# EAGLE design trainer (EAGLE 7.3.0)
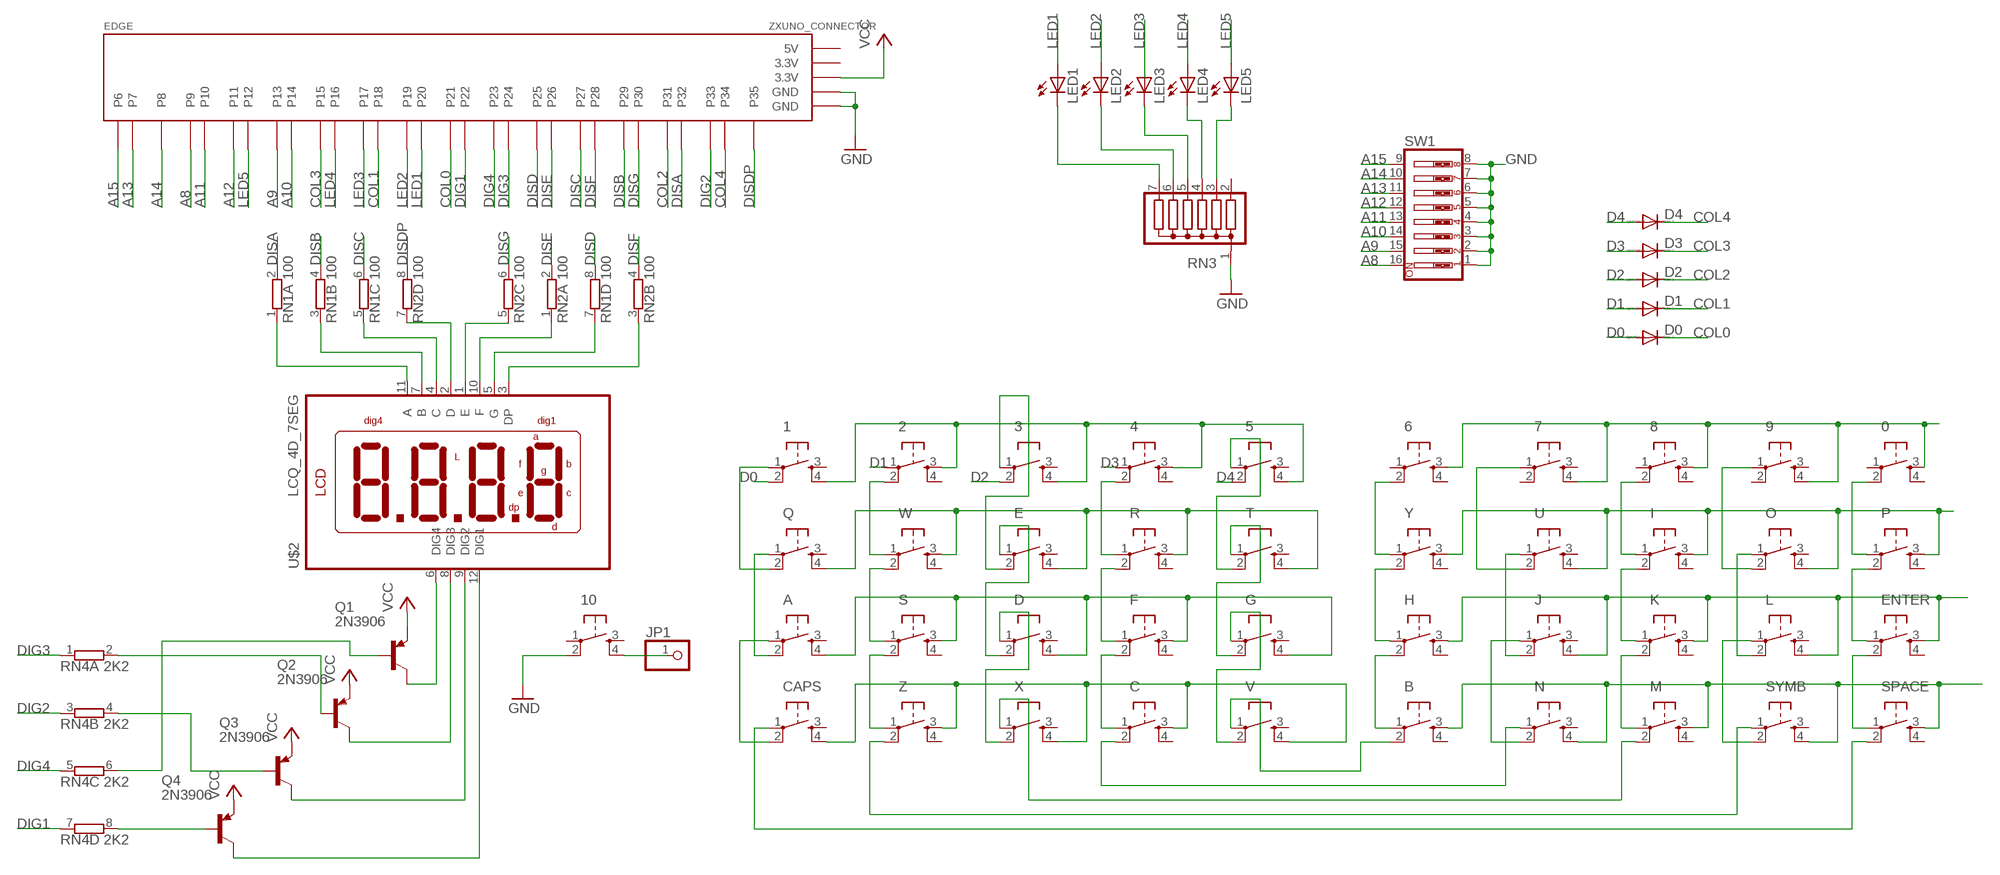
[diagram p0: schematic, sheet 1]

## Parts
0  DTS-6  [DTS-6]
1  DTS-6  [DTS-6]
2  DTS-6  [DTS-6]
3  DTS-6  [DTS-6]
4  DTS-6  [DTS-6]
5  DTS-6  [DTS-6]
6  DTS-6  [DTS-6]
7  DTS-6  [DTS-6]
8  DTS-6  [DTS-6]
9  DTS-6  [DTS-6]
10  DTS-6  [DTS-6]
A  DTS-6  [DTS-6]
B  DTS-6  [DTS-6]
C  DTS-6  [DTS-6]
CAPS  DTS-6  [DTS-6]
D  DTS-6  [DTS-6]
D0  1N4148DO35-7  [DO35-7]
D1  1N4148DO35-7  [DO35-7]
D2  1N4148DO35-7  [DO35-7]
D3  1N4148DO35-7  [DO35-7]
D4  1N4148DO35-7  [DO35-7]
E  DTS-6  [DTS-6]
EDGE  ZXUNO_CONNECTOR  [ZXUNO_CONNECTOR]
ENTER  DTS-6  [DTS-6]
F  DTS-6  [DTS-6]
G  DTS-6  [DTS-6]
H  DTS-6  [DTS-6]
I  DTS-6  [DTS-6]
J  DTS-6  [DTS-6]
JP1  PINHD-1X1  [1X01]
K  DTS-6  [DTS-6]
L  DTS-6  [DTS-6]
LED1  LED3MM  [LED3MM]
LED2  LED3MM  [LED3MM]
LED3  LED3MM  [LED3MM]
LED4  LED3MM  [LED3MM]
LED5  LED3MM  [LED3MM]
M  DTS-6  [DTS-6]
N  DTS-6  [DTS-6]
O  DTS-6  [DTS-6]
P  DTS-6  [DTS-6]
Q  DTS-6  [DTS-6]
Q1  2N3906  [TO92]
Q2  2N3906  [TO92]
Q3  2N3906  [TO92]
Q4  2N3906  [TO92]
R  DTS-6  [DTS-6]
RN1  100  E4R  [SIL8]
RN2  100  E4R  [SIL8]
RN3  G06R  [SIL7]
RN4  2K2  E4R  [SIL8]
S  DTS-6  [DTS-6]
SPACE  DTS-6  [DTS-6]
SW1  SW_DIP-8  [EDG-08]
SYMB  DTS-6  [DTS-6]
T  DTS-6  [DTS-6]
U  DTS-6  [DTS-6]
U$2  LCQ_4D_7SEG  [LDQ_4D_7SEG]
V  DTS-6  [DTS-6]
W  DTS-6  [DTS-6]
X  DTS-6  [DTS-6]
Y  DTS-6  [DTS-6]
Z  DTS-6  [DTS-6]

## Nets
A8: C.3 CAPS.4 EDGE.P9 SW1.16 V.4 X.4 Z.3
A9: A.4 D.4 EDGE.P13 F.3 G.4 S.3 SW1.15
A10: E.4 EDGE.P14 Q.4 R.3 SW1.14 T.4 W.3
A11: 1.4 2.3 3.4 4.3 5.4 EDGE.P10 SW1.13
A12: 0.3 6.3 7.4 8.3 9.4 EDGE.P11 SW1.12
A13: EDGE.P7 I.3 O.4 P.3 SW1.11 U.4 Y.3
A14: EDGE.P8 ENTER.3 H.3 J.4 K.3 L.4 SW1.10
A15: B.3 EDGE.P6 M.3 N.4 SPACE.3 SW1.9 SYMB.4
COL0: D0.C EDGE.P21
COL1: D1.C EDGE.P18
COL2: D2.C EDGE.P31
COL3: D3.C EDGE.P15
COL4: D4.C EDGE.P34
D0: 1.2 D0.A
D1: 2.1 D1.A
D2: 3.2 D2.A
D3: 4.1 D3.A
D4: 5.2 D4.A
DIG1: EDGE.P22 RN4.7
DIG2: EDGE.P33 RN4.3
DIG3: EDGE.P24 RN4.1
DIG4: EDGE.P23 RN4.5
DISA: EDGE.P32 RN1.2
DISB: EDGE.P29 RN1.4
DISC: EDGE.P27 RN1.6
DISD: EDGE.P25 RN1.8
DISDP: EDGE.P35 RN2.8
DISE: EDGE.P26 RN2.2
DISF: EDGE.P28 RN2.4
DISG: EDGE.P30 RN2.6
ELETE: M.2 X.1
GND: 10.2 EDGE.GND@1(GND) EDGE.GND@2(GND) RN3.1 SW1.1 SW1.2 SW1.3 SW1.4 SW1.5 SW1.6 SW1.7 SW1.8
LED1: EDGE.P20 LED1.A
LED2: EDGE.P19 LED2.A
LED3: EDGE.P17 LED3.A
LED4: EDGE.P16 LED4.A
LED5: EDGE.P12 LED5.A
N$1: Q1.1(C) U$2.6(DIG4)
N$2: Q2.1(C) U$2.8(DIG3)
N$3: Q3.1(C) U$2.9(DIG2)
N$4: Q4.1(C) U$2.12(DIG1)
N$5: Q2.2(B) RN4.2
N$6: Q1.2(B) RN4.6
N$7: Q3.2(B) RN4.4
N$8: Q4.2(B) RN4.8
N$9: RN1.1 U$2.11(A)
N$10: RN1.3 U$2.7(B)
N$11: RN1.5 U$2.4(C)
N$12: RN2.7 U$2.2(D)
N$13: RN2.5 U$2.1(E)
N$14: RN2.1 U$2.10(F)
N$15: 10.4 JP1.1
N$16: S.1 W.2
N$17: S.2 Z.1
N$18: RN2.3 U$2.3(DP)
N$19: SYMB.1 Z.2
N$20: RN1.7 U$2.5(G)
N$21: C.1 F.2
N$22: CAPS.1 SPACE.2
N$23: 4.2 R.1
N$24: F.1 R.2
N$25: LED4.K(C) RN3.4
N$26: LED5.K(C) RN3.3
N$27: LED3.K(C) RN3.5
N$28: B.2 V.1
N$29: 5.1 T.2
N$30: G.2 T.1
N$31: A.2 Q.1
N$32: J.2 U.1
N$33: J.1 N.2
N$34: 3.1 E.2
N$35: D.2 E.1
N$36: A.1 CAPS.2
N$37: 1.1 Q.2
N$38: K.2 M.1
N$39: 2.2 W.1
N$40: 7.1 U.2
N$41: LED2.K(C) RN3.6
N$42: G.1 V.2
N$43: C.2 N.1
N$44: L.1 SYMB.2
N$46: LED1.K(C) RN3.7
N$47: I.2 K.1
N$48: 8.2 I.1
N$49: L.2 O.1
N$50: B.1 H.2
N$51: H.1 Y.2
N$52: ENTER.2 SPACE.1
N$53: ENTER.1 P.2
N$54: 0.2 P.1
N$55: 6.2 Y.1
N$56: 9.1 O.2
N$74: D.1 X.2
VCC: EDGE.3.3V@2(3.3V) Q1.3(E) Q2.3(E) Q3.3(E) Q4.3(E)
Unconnected: 0.1 0.4 1.3 2.4 3.3 4.4 5.3 6.1 6.4 7.2 7.3 8.1 8.4 9.2 9.3 10.1 10.3 A.3 B.4 C.4 CAPS.3 D.3 E.3 ENTER.4 F.4 G.3 H.4 I.4 J.3 K.4 L.3 M.4 N.3 O.3 P.4 Q.3 R.4 RN3.2 S.4 SPACE.4 SYMB.3 T.3 U.3 V.3 W.4 X.3 Y.4 Z.4

## Power pins joined to a net without a drawn wire
3.3V: EDGE.3.3V@1(3.3V)
5V: EDGE.5V

## Library data of the parts
0 1-10 A B C CAPS D E ENTER F G H I J K L M N O P Q R S SPACE SYMB T U V W X Y Z = switch-tact:DTS-6
D0 D1-D4 = diode:1N4148: DIODE high speed (Philips)
EDGE = zxuno:ZXUNO_CONNECTOR
JP1 = pinhead:PINHD-1X1: PIN HEADER
LED1-LED5 = led:LED: LED OSRAM: - CHIPLED LG R971, LG N971, LY N971, LG Q971, LY Q971, LO R971, LY R971 LH N974, LH R974 LS Q976, LO Q976, LY Q976 LO Q996 - Hyper CHIPLED LW Q18S LB Q993, LB Q99A, LB R99A - SideLED LS A670, LO A670, LY A670, LG A670, LP A670 LB A673, LV A673, LT A673, LW A673 LH A674 LY A675 LS A676, LA A676, LO A676, LY A676, LW A676 LS A679, LY A679, LG A679 - Hyper Micro SIDELED® LS Y876, LA Y876, LO Y876, LY Y876 LT Y87S - SmartLED LW L88C, LW L88S LB L89C, LB L89S, LG L890 LS L89K, LO L89K, LY L89K LS L896, LA L896, LO L896, LY L896 - TOPLED LS T670, LO T670, LY T670, LG T670, LP T670 LSG T670, LSP T670, LSY T670, LOP T670, LYG T670 LG T671, LOG T671, LSG T671 LB T673, LV T673, LT T673, LW T673 LH T674 LS T676, LA T676, LO T676, LY T676, LB T676, LH T676, LSB T676, LW T676 LB T67C, LV T67C, LT T67C, LS T67K, LO T67K, LY T67K, LW E67C LS E67B, LA E67B, LO E67B, LY E67B, LB E67C, LV E67C, LT E67C LW T67C LS T679, LY T679, LG T679 LS T770, LO T770, LY T770, LG T770, LP T770 LB T773, LV T773, LT T773, LW T773 LH T774 LS E675, LA E675, LY E675, LS T675 LS T776, LA T776, LO T776, LY T776, LB T776 LHGB T686 LT T68C, LB T68C - Hyper Mini TOPLED® LB M676 - Mini TOPLED Santana® LG M470 LS M47K, LO M47K, LY M47K Source: http://www.osram.convergy.de LUXEON: - LUMILED® LXK2-PW12-R00, LXK2-PW12-S00, LXK2-PW14-U00, LXK2-PW14-V00 LXK2-PM12-R00, LXK2-PM12-S00, LXK2-PM14-U00 LXK2-PE12-Q00, LXK2-PE12-R00, LXK2-PE12-S00, LXK2-PE14-T00, LXK2-PE14-U00 LXK2-PB12-K00, LXK2-PB12-L00, LXK2-PB12-M00, LXK2-PB14-N00, LXK2-PB14-P00, LXK2-PB14-Q00 LXK2-PR12-L00, LXK2-PR12-M00, LXK2-PR14-Q00, LXK2-PR14-R00 LXK2-PD12-Q00, LXK2-PD12-R00, LXK2-PD12-S00 LXK2-PH12-R00, LXK2-PH12-S00 LXK2-PL12-P00, LXK2-PL12-Q00, LXK2-PL12-R00 Source: www.luxeon.com KINGBRIGHT: KA-3528ASYC Source: www.kingbright.com
Q1-Q4 = transistor-pnp:2N3906: PNP Transistor
RN1 RN2 RN4 = resistor-sil:E4R: SIL RESISTOR; OC_FARNELL: unknown; OC_NEWARK: unknown
RN3 = resistor-sil:G06R: SIL RESISTOR; OC_FARNELL: unknown; OC_NEWARK: unknown
SW1 = special:SW_DIP-8: DIP SWITCH
U$2 = mylib:LCQ_4D_7SEG

## Board
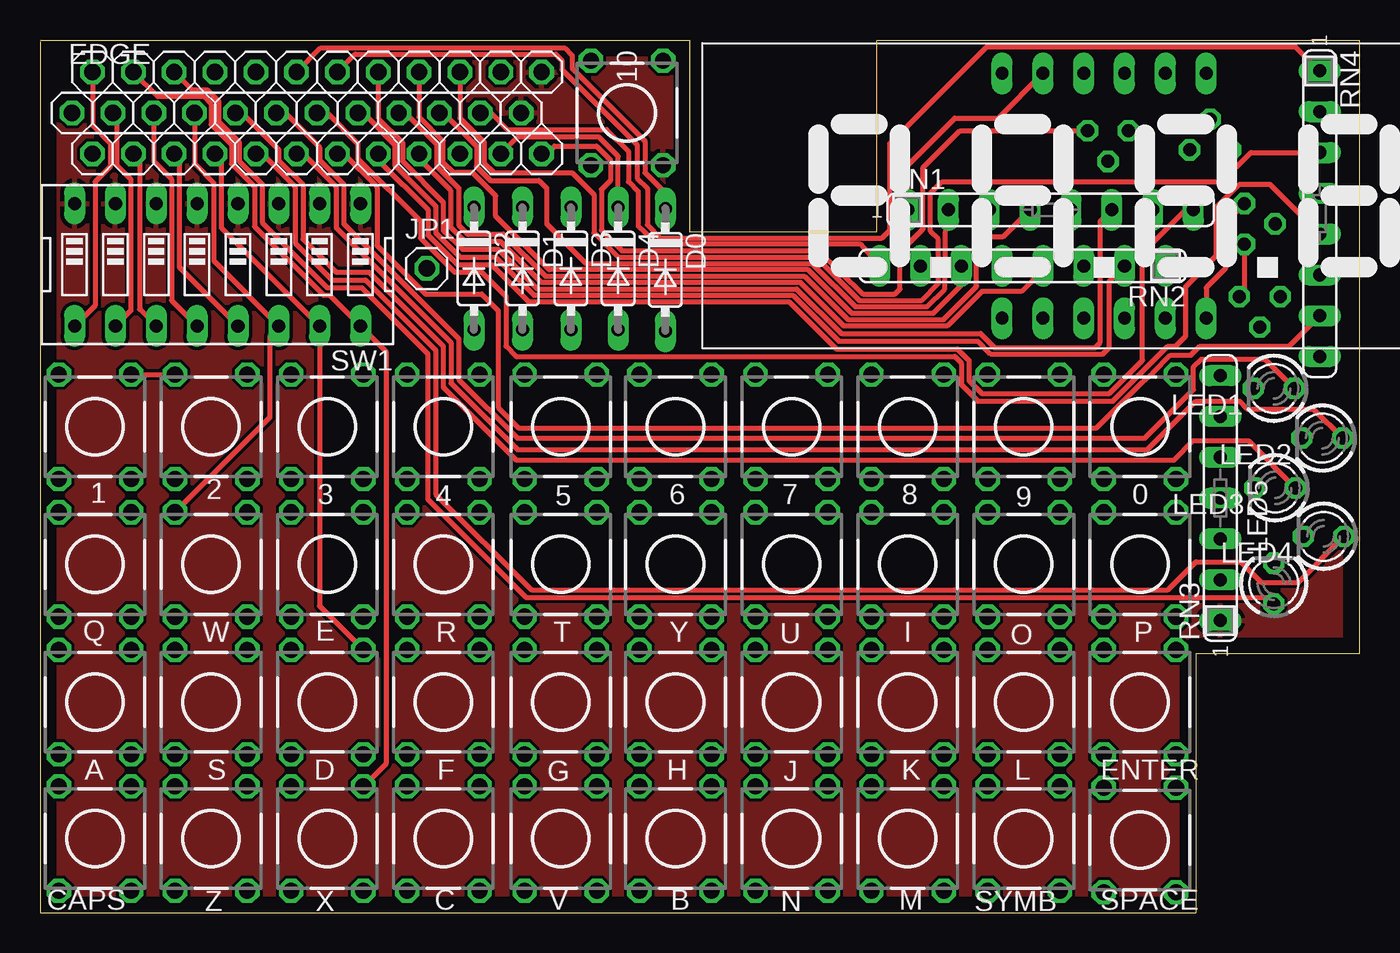
[diagram p1: board, top side]
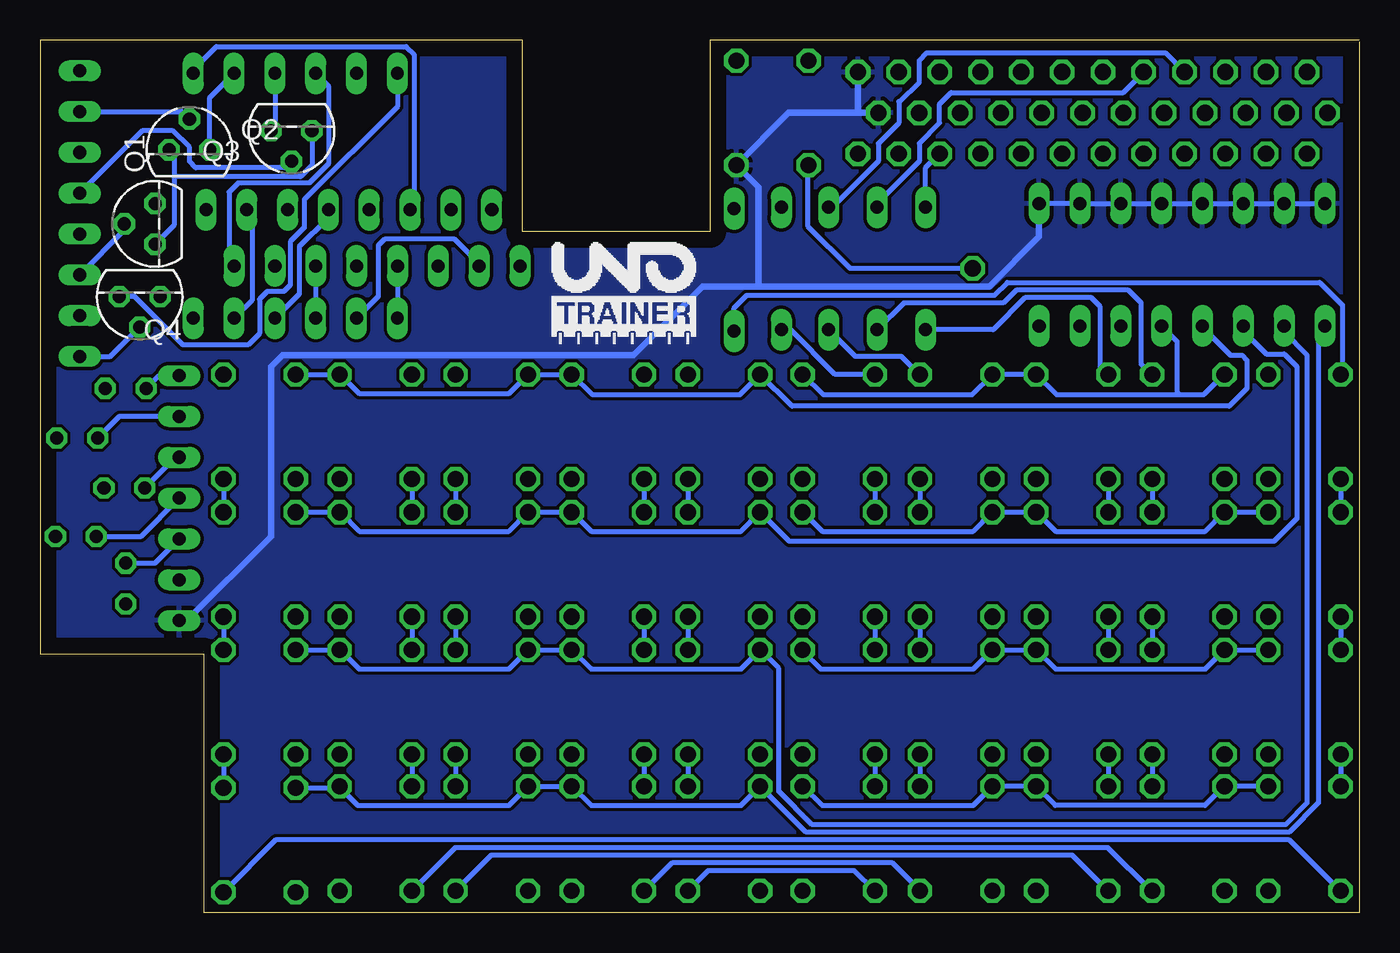
[diagram p2: board, bottom side, seen from below]

Size 82.07 x 54.29 mm. Coordinates in mm from the lower left corner, seen from the top.
Outline: 0,54.2 0,0 71.91,0 71.91,16.11 82.07,16.11 82.07,54.29 52.07,54.29 52.07,42.39 40.4,42.39 40.4,54.29 0,54.29
Copper layers (1*16): Top 0.035mm / dielectric 1.5mm / Bottom 0.035mm
Design rules "default": minimum track width 10mil, minimum drill 24mil, track to track 8mil, track to pad 8mil, pad to pad 8mil, via to via 8mil, smd to smd 8mil, copper to edge 40mil, drill to drill 8mil, minimum pad ring 10mil, minimum via ring 8mil, stop-mask expansion 4mil, vias tented up to drill 0mil, thermal gap 10mil

### Footprints (pad centres in the part's own frame; a part is rotated, then mirrored left to right if it is on the bottom)
DTS-6 = drill 1 octagon: 1 -3.25,2.25; 2 3.25,2.25; 3 -3.25,-2.25; 4 3.25,-2.25
DO35-7 = drill 0.813 long: A 3.81,0; C -3.81,0
ZXUNO_CONNECTOR = drill 1.016 octagon: 3.3V@1 -13.97,0; 3.3V@2 15.24,-2.54; 5V -12.7,-2.54; GND@1 15.24,2.54; GND@2 13.97,0; NC@1 12.7,2.54; P6 -12.7,2.54; P7 -10.16,-2.54; P8 -11.43,0; P9 -10.16,2.54; P10 -7.62,-2.54; P11 -8.89,0; P12 -7.62,2.54; P13 -5.08,-2.54; P14 -6.35,0; P15 -5.08,2.54; P16 -2.54,-2.54; P17 -3.81,0; P18 -2.54,2.54; P19 0,-2.54; P20 -1.27,0; P21 0,2.54; P22 2.54,-2.54; P23 1.27,0; P24 2.54,2.54; P25 5.08,-2.54; P26 3.81,0; P27 5.08,2.54; P28 7.62,-2.54; P29 6.35,0; P30 7.62,2.54; P31 10.16,-2.54; P32 8.89,0; P33 10.16,2.54; P34 12.7,-2.54; P35 11.43,0
1X01 = drill 1.016 octagon: 1 0,0
LED3MM = drill 0.813 octagon: A -1.27,0; K 1.27,0
TO92 = drill 0.813 octagon: 1 1.27,0; 2 0,1.905; 3 -1.27,0
SIL8 = drill 0.813 long: 1 -8.89,0; 2 -6.35,0; 3 -3.81,0; 4 -1.27,0; 5 1.27,0; 6 3.81,0; 7 6.35,0; 8 8.89,0
SIL7 = drill 0.813 long: 1 -7.62,0; 2 -5.08,0; 3 -2.54,0; 4 0,0; 5 2.54,0; 6 5.08,0; 7 7.62,0
EDG-08 = drill 0.813 long: 1 -8.89,-3.81; 2 -6.35,-3.81; 3 -3.81,-3.81; 4 -1.27,-3.81; 5 1.27,-3.81; 6 3.81,-3.81; 7 6.35,-3.81; 8 8.89,-3.81; 9 8.89,3.81; 10 6.35,3.81; 11 3.81,3.81; 12 1.27,3.81; 13 -1.27,3.81; 14 -3.81,3.81; 15 -6.35,3.81; 16 -8.89,3.81
LDQ_4D_7SEG = drill 0.8 long: 1 -6.35,-7.62; 2 -3.81,-7.62; 3 -1.27,-7.62; 4 1.27,-7.62; 5 3.81,-7.62; 6 6.35,-7.62; 7 6.35,7.62; 8 3.81,7.62; 9 1.27,7.62; 10 -1.27,7.62; 11 -3.81,7.62; 12 -6.35,7.62

### Placement (x,y rotation side)
0  68.42,30.24 270 top
1  3.41,30.24 90 top
2  10.64,30.24 270 top
3  17.86,30.24 90 top
4  25.08,30.24 270 top
5  32.38,30.24 90 top
6  39.53,30.24 270 top
7  46.75,30.24 90 top
8  53.98,30.24 270 top
9  61.2,30.24 90 top
10  36.51,49.77 270 top
A  3.41,13.1 90 top
B  39.53,4.6 270 top
C  25.08,4.6 270 top
CAPS  3.41,4.6 90 top
D  17.86,13.1 90 top
D0  38.89,40.01 270 top
D1  30,40.08 270 top
D2  26.99,40.08 270 top
D3  33.02,40.08 270 top
D4  35.96,40.08 270 top
E  17.86,21.67 90 top
EDGE  15.95,49.77 0 top
ENTER  68.42,13.1 270 top
F  25.08,13.1 270 top
G  32.38,13.1 90 top
H  39.53,13.1 270 top
I  53.98,21.67 270 top
J  46.75,13.1 90 top
JP1  24.05,40.08 0 top
K  53.98,13.1 270 top
L  61.2,13.1 90 top
LED1  76.76,32.62 180 top
LED2  79.77,29.53 180 top
LED3  76.83,26.43 180 top
LED4  79.85,23.42 180 top
LED5  76.76,20.48 90 top
M  53.98,4.6 270 top
N  46.75,4.6 90 top
O  61.2,21.67 90 top
P  68.42,21.67 270 top
Q  3.41,21.67 90 top
Q1  74.93,42.86 90 bottom
Q2  72.79,47.47 0 bottom
Q3  66.44,48.66 180 bottom
Q4  75.88,38.34 180 bottom
R  25.08,21.67 270 top
RN1  62.87,43.74 0 top
RN2  61.12,40.24 180 top
RN3  73.42,25.8 90 top
RN4  79.61,43.5 270 top
S  10.64,13.1 270 top
SPACE  68.42,4.52 270 top
SW1  11.03,40.32 180 top
SYMB  61.2,4.6 90 top
T  32.38,21.67 90 top
U  46.75,21.67 90 top
U$2  66.2,44.61 0 top
V  32.38,4.6 90 top
W  10.64,21.67 270 top
X  17.86,4.6 90 top
Y  39.53,21.67 270 top
Z  10.64,4.6 270 top

### Tracks (layer width: path | path; a pad name or v marks a point on that pad's centre or on a via)
A8
  Top 0.305: X.4 21.51,9.26 21.51,34.92 SW1.16 18.02,38.42 17.62,38.42 13.34,42.7 13.34,45.16 11.91,46.59 11.91,47.78 10.64,49.05 10.64,50.32 10.16,50.8 7.3,50.8 EDGE.P9
  Bottom 0.305: CAPS.4 Z.3 8.42,7.85 9.6,6.67 18.92,6.67 X.4 C.3 24.02,6.67 33.42,6.67 34.6,7.85 V.4
A9
  Top 0.305: D.4 17.38,19.07 SW1.15 11.27,42.62 11.27,46.83 EDGE.P13
  Bottom 0.305: G.4 34.63,16.3 33.5,15.16 24.02,15.16 F.3 D.4 20.08,16.35 18.89,15.16 9.57,15.16 S.3 A.4
A10
  Top 0.305: W.3 14.29,30.82 14.29,35.88 14.84,36.43 SW1.14 10.79,40.56 10.79,45.4 9.6,46.59 EDGE.P14
  Bottom 0.305: T.4 34.6,24.92 33.42,23.73 24.02,23.73 R.3 E.4 20.08,24.92 18.89,23.73 9.57,23.73 W.3 Q.4
A11
  Top 0.305: 1.4 2.3 | EDGE.P10 8.65,46.91 8.65,40.16 SW1.13
  Bottom 0.305: 2.3 8.42,33.49 9.68,32.23 11.19,32.23 | 5.4 34.6,33.49 33.34,32.23 24.1,32.23 4.3 3.4 18.84,32.23 11.19,32.23 | SW1.13 11.35,35.56 11.35,32.38 11.19,32.23
A12
  Top 0.305: SW1.12 8.18,38.1 8.18,45.64 7.06,46.75 EDGE.P11
  Bottom 0.305: 0.3 9.4 63.42,33.49 62.23,32.31 52.91,32.31 8.3 7.4 48.97,33.49 47.7,32.23 38.54,32.23 6.3 35.3,31.51 8.1,31.51 6.99,32.62 6.99,34.37 7.3,34.69 8.02,34.69 9.76,36.43 SW1.12
A13
  Top 0.305: EDGE.P7 6.19,46.83 6.19,37.54 SW1.11
  Bottom 0.305: P.3 O.4 63.42,24.92 62.23,23.73 52.91,23.73 I.3 U.4 48.97,24.92 47.78,23.73 38.47,23.73 Y.3 35.46,23.1 5.32,23.1 3.89,24.53 3.89,33.97 4.68,34.77 5.79,34.77 7.22,36.2 SW1.11
A14
  Top 0.305: EDGE.P8 4.76,49.53 4.76,46.51 5.64,45.64 5.64,37.47 SW1.10
  Bottom 0.305: ENTER.3 L.4 63.42,16.35 62.23,15.16 52.91,15.16 K.3 | K.3 J.4 | K.3 48.97,16.35 47.78,15.16 38.47,15.16 H.3 36.12,15.18 36.12,7.54 34.05,5.48 4.6,5.48 3.25,6.83 3.25,34.69 4.68,36.12 SW1.10
A15
  Top 0.305: EDGE.P6 3.25,48.97 4.37,47.86 4.37,46.43 3.41,45.48 3.41,37.78 SW1.9
  Bottom 0.305: SPACE.3 63.45,7.77 | 63.45,7.77 SYMB.4 | 63.45,7.77 63.42,7.77 62.31,6.67 52.91,6.67 M.3 N.4 48.97,7.85 47.78,6.67 38.47,6.67 B.3 34.43,5 4.37,5 2.54,6.83 2.54,36.12 SW1.9
COL0
  Top 0.305: EDGE.P21 17.46,53.82 32.62,53.82 33.1,53.34 33.1,52.55 37.62,48.02 37.62,46.04 38.89,44.77 D0.C
COL1
  Bottom 0.305: D1.C 30,44.13 27.38,46.75 27.38,47.86 26.11,49.13 26.11,50.32 25.4,51.04 14.68,51.04 EDGE.P18
COL2
  Bottom 0.305: D2.C 26.99,46.35 EDGE.P31
COL3
  Bottom 0.305: D3.C 32.78,43.89 29.92,46.75 29.92,47.86 28.65,49.13 28.65,50.48 28.57,50.48 27.38,51.67 27.38,53.02 26.91,53.5 12.06,53.5 EDGE.P15
COL4
  Top 0.305: D4.C 35.96,47.07 34.77,48.26 29.69,48.26 EDGE.P34
D0
  Bottom 0.305: 1.2 1.16,33.52 1.03,33.66 1.03,37.78 2.46,39.21 21.91,39.21 22.7,38.42 38.1,38.42 38.89,37.62 D0.A
D1
  Bottom 0.305: 2.1 12.93,33.49 13.57,34.13 13.57,37.94 14.37,38.73 21.35,38.73 22.15,37.94 28.34,37.94 D1.A
D2
  Bottom 0.305: 3.2 15.63,33.49 16.11,33.97 16.11,37.7 16.67,38.26 20.8,38.26 22.78,36.27 D2.A
D3
  Bottom 0.305: 4.1 27.38,33.49 28.5,34.61 31.35,34.61 D3.A
D4
  Bottom 0.305: 5.2 32.62,33.49 35.4,36.27 D4.A
DIG1
  Top 0.305: EDGE.P22 18.89,47.23 20.95,45.16 20.95,41.51 23.97,38.5 27.46,38.5 28.5,37.47 28.5,31.43 29.77,30.16 65.72,30.16 68.58,33.02 69.22,33.58 70.33,34.69 71.6,34.69 72.15,35.24 77.71,35.24 RN4.7
DIG2
  Top 0.305: EDGE.P33 26.11,49.45 27.62,47.94 27.62,46.67 28.26,46.04 33.1,46.04 34.45,44.69 34.45,42.31 35.96,40.8 48.26,40.8 50.96,38.1 54.85,38.1 55.88,39.13 55.88,41.91 55.4,42.39 55.4,44.77 56.12,45.48 73.5,45.48 75.33,47.31 RN4.3
DIG3
  Top 0.305: EDGE.P24 19.61,53.42 32.07,53.42 32.46,53.02 32.46,52.47 37.15,47.78 37.15,45.72 37.78,45.09 37.78,42.78 38.58,41.99 52.39,41.99 52.86,42.47 52.86,47.86 58.9,53.9 78.11,53.9 RN4.1
DIG4
  Top 0.305: EDGE.P23 17.86,49.77 19.76,47.86 19.76,46.91 23.65,43.02 23.65,41.99 25.8,39.85 27.46,39.85 28.97,38.34 28.97,35.24 29.61,34.61 56.91,34.61 57.31,34.21 57.31,32.86 58.34,31.83 66.75,31.83 70.17,35.24 70.64,35.24 71.28,35.88 71.28,38.97 73.18,40.88 73.18,43.89 74.61,45.32 76.52,45.32 RN4.5
DISA
  Top 0.305: EDGE.P32 25.08,49.77 27.15,47.7 27.15,46.43 28.02,45.56 31.04,45.56 31.51,45.09 31.51,42.86 33.97,40.4 48.02,40.4 50.72,37.7 55.17,37.7 56.28,38.81 56.36,43.58 RN1.2
DISB
  Top 0.305: RN1.4 59.93,42.07 59.05,42.07 58.26,41.27 58.26,38.97 56.2,36.91 50.24,36.91 47.55,39.61 31.43,39.61 28.81,42.23 26.59,42.23 26.04,42.78 26.04,45.09 24.69,46.43 24.69,47.78 22.7,49.77 EDGE.P29
DISC
  Top 0.305: EDGE.P27 21.03,49.45 22.54,47.94 22.54,46.75 25.08,44.21 25.08,42.47 26.27,41.27 28.5,41.27 30.96,38.81 47.07,38.81 49.85,36.04 58.5,36.04 59.37,35.16 65.64,35.16 65.96,35.48 65.96,43.02 RN1.6
DISD
  Top 0.305: EDGE.P25 21.03,46.83 24.13,43.74 24.13,42.15 25.96,40.32 28.1,40.32 30.4,38.02 46.59,38.02 49.53,35.08 57.07,35.08 57.78,34.37 57.78,33.1 58.58,32.31 66.52,32.31 68.58,34.37 68.58,41.04 71.28,43.74 RN1.8
DISDP
  Top 0.305: RN2.8 51.04,41.59 38.42,41.59 37.23,42.7 37.23,44.85 36.59,45.48 36.59,47.39 35.24,48.74 29.05,48.74 28.02,49.77 EDGE.P35
DISE
  Top 0.305: EDGE.P26 20.08,49.77 22.07,47.78 22.07,46.51 24.61,43.97 24.61,42.31 26.11,40.8 28.34,40.8 30.72,38.42 46.83,38.42 49.69,35.56 58.34,35.56 59.13,34.77 66.12,34.77 66.52,35.16 66.52,39.29 RN2.2
DISF
  Top 0.305: RN2.4 62.39,40.01 61.04,38.66 58.58,38.66 56.44,36.51 50.01,36.51 47.31,39.21 31.19,39.21 28.65,41.75 26.43,41.75 25.56,42.62 25.56,44.93 23.57,46.91 EDGE.P28
DISG
  Top 0.305: RN2.6 57.31,39.05 55.56,37.31 50.48,37.31 47.78,40.01 31.67,40.01 28.34,43.34 28.34,44.61 26.91,46.04 25.72,46.04 25.08,46.67 25.08,48.02 23.57,49.53 EDGE.P30
ELETE
  Bottom 0.305: X.1 15.64,1.35 17.86,3.57 54.01,3.57 M.2
GND
  Bottom 0.305: SW1.1 SW1.2 SW1.3 SW1.4 SW1.5 SW1.6 SW1.7 SW1.8
  Bottom 0.406: RN3.1 72.95,18.18 67.71,23.42 67.71,33.97 66.99,34.69 45.16,34.69 40.88,38.97 37.39,38.97 | EDGE.GND@2 31.04,49.77 | 31.04,49.77 35.51,49.77 10.2 37.39,45.14 37.39,38.97 | EDGE.GND@1 31.19,49.93 31.04,49.77 | SW1.1 19.92,42.07 23.02,38.97 37.39,38.97
  pour Top: 0.32,53.98 40.08,53.98 40.08,41.91 52.47,41.91 52.47,53.9 81.84,53.9 81.84,16.43 71.68,16.43 71.68,0.48 0.32,0.48
  pour Bottom: 0.32,53.98 40.08,53.98 40.08,41.91 52.47,41.91 52.47,53.9 81.84,53.9 81.84,16.43 71.68,16.43 71.68,0.48 0.32,0.48
LED1
  Top 0.305: EDGE.P20 15.24,49.77 17.38,47.62 17.38,46.83 18.89,45.32 18.89,42.86 26.04,35.72 26.04,33.18 29.69,29.53 68.74,29.53 71.75,32.54 71.75,33.97 72.23,34.45 76.2,34.45 LED1.A
LED2
  Top 0.305: EDGE.P19 16.35,47.23 18.41,45.16 18.41,42.62 25.56,35.48 25.56,32.94 29.69,28.81 68.9,28.81 71.91,31.83 74.61,31.83 75.09,31.35 79.22,31.35 LED2.A
LED3
  Top 0.305: EDGE.P17 12.54,49.77 14.84,47.47 14.84,46.83 16.35,45.32 16.35,41.91 18.41,39.85 20.48,39.85 25.08,35.24 25.08,32.7 29.61,28.18 70.56,28.18 71.75,29.37 75.17,29.37 LED3.A
LED4
  Top 0.305: EDGE.P16 13.81,47.23 15.88,45.16 15.88,41.67 18.18,39.37 20.24,39.37 24.61,35 24.61,26.04 30.56,20.08 70.17,20.08 71.91,21.83 74.69,21.83 75.96,20.56 78.26,20.56 LED4.A
LED5
  Top 0.305: EDGE.P12 9.45,51.2 10.4,51.2 11.11,50.48 11.11,49.21 12.38,47.94 12.38,46.75 13.81,45.32 13.81,42.94 17.86,38.89 20,38.89 24.13,34.77 24.13,25.72 30.24,19.61 76.36,19.61 LED5.A
N$1
  Top 0.305: Q1.1 73.74,42.94 73.74,40.08 72.55,38.89 U$2.6
N$2
  Bottom 0.305: Q2.1 71.52,50.72 U$2.8
N$3
  Bottom 0.305: U$2.9 67.47,48.9 Q3.1
N$4
  Bottom 0.305: U$2.12 59.85,50.16 65.64,44.37 65.64,42.62 66.52,41.75 66.52,39.05 66.91,38.66 67.94,38.66 68.42,38.18 68.42,36.04 69.14,35.32 73.18,35.32 76.2,38.34 Q4.1
N$5
  Bottom 0.305: RN4.2 73.26,49.85 Q2.2
N$6
  Bottom 0.305: Q1.2 76.83,42.47 RN4.6
N$7
  Bottom 0.305: Q3.2 66.83,46.35 72.39,46.35 72.79,46.75 72.79,47.62 73.82,48.66 75.72,48.66 RN4.4
N$8
  Bottom 0.305: RN4.8 77.71,34.61 Q4.2
N$9
  Top 0.305: RN1.1 53.98,46.51 56.91,49.45 59.61,49.45 U$2.11
N$10
  Bottom 0.305: U$2.7 72.55,52.47 71.12,53.9 59.29,53.9 58.82,53.42 58.82,43.97 RN1.3
N$11
  Bottom 0.305: U$2.4 65.96,38.5 65.96,41.43 64.14,43.26 RN1.5
N$12
  Bottom 0.305: RN2.7 54.77,40.4 56.28,41.91 60.64,41.91 61.04,41.51 61.04,38.34 U$2.2
N$13
  Bottom 0.305: RN2.5 U$2.1
N$14
  Bottom 0.305: U$2.10 64.14,51.44 64.14,46.59 65.33,45.4 69.77,45.4 70.33,44.85 70.33,40.56 RN2.1
N$15
  Bottom 0.305: JP1.1 31.67,40.08 34.29,42.7 34.29,46.49 10.4
N$16
  Bottom 0.305: W.2 S.1
N$17
  Bottom 0.305: S.2 Z.1
N$18
  Bottom 0.305: RN2.3 U$2.3
N$19
  Bottom 0.305: Z.2 12.94,1.35 15.64,4.05 56.25,4.05 SYMB.1
N$20
  Bottom 0.305: RN1.7 68.9,43.42 68.9,38.1 U$2.5
N$21
  Bottom 0.305: F.2 C.1
N$22
  Bottom 0.305: CAPS.1 1.2,1.35 4.37,4.52 67.42,4.52 SPACE.2
N$23
  Bottom 0.305: 4.2 R.1
N$24
  Bottom 0.305: R.2 F.1
N$25
  Bottom 0.305: LED4.K 75.8,23.42 RN3.4
N$26
  Bottom 0.305: LED5.K 74.93,21.75 RN3.3
N$27
  Bottom 0.305: RN3.5 73.66,28.34 LED3.K
N$28
  Bottom 0.305: V.1 30.17,1.35 31.43,2.62 40.51,2.62 B.2
N$29
  Bottom 0.305: 5.1 T.2
N$30
  Bottom 0.305: T.1 G.2
N$31
  Bottom 0.305: Q.1 A.2
N$32
  Bottom 0.305: U.1 J.2
N$33
  Bottom 0.305: J.1 N.2
N$34
  Bottom 0.305: 3.1 E.2
N$35
  Bottom 0.305: E.1 D.2
N$36
  Bottom 0.305: A.1 CAPS.2
N$37
  Bottom 0.305: 1.1 Q.2
N$38
  Bottom 0.305: K.2 M.1
N$39
  Bottom 0.305: 2.2 W.1
N$40
  Bottom 0.305: 7.1 U.2
N$41
  Bottom 0.305: RN3.6 77.15,30.88 LED2.K
N$42
  Bottom 0.305: G.1 V.2
N$43
  Bottom 0.305: C.2 27.33,1.38 29.05,3.1 42.76,3.1 N.1
N$44
  Bottom 0.305: L.1 SYMB.2
N$46
  Bottom 0.305: RN3.7 74.69,33.42 LED1.K
N$47
  Bottom 0.305: I.2 K.1
N$48
  Bottom 0.305: 8.2 I.1
N$49
  Bottom 0.305: O.1 L.2
N$50
  Bottom 0.305: H.2 B.1
N$51
  Bottom 0.305: Y.2 H.1
N$52
  Bottom 0.305: ENTER.2 SPACE.1
N$53
  Bottom 0.305: P.2 ENTER.1
N$54
  Bottom 0.305: 0.2 P.1
N$55
  Bottom 0.305: 6.2 Y.1
N$56
  Bottom 0.305: 9.1 O.2
N$74
  Bottom 0.305: D.1 X.2
VCC
  Top 0.305: EDGE.3.3V@2 31.51,47.23 31.99,47.7 34.61,47.7 35.48,46.83 35.48,45.56 34.92,45.01 34.92,42.47 36.2,41.2 48.42,41.2 51.2,38.5 53.18,38.5 53.5,38.81 53.5,41.12 54.93,42.55 54.93,46.35 57.23,48.66 Q3.3 | Q1.3 74.93,38.66 Q4.3
  Bottom 0.305: Q2.3 73.74,47.15 73.74,45.8 | 73.74,45.8 73.74,42.78 Q1.3 | Q3.3 65.17,46.51 65.88,45.8 73.74,45.8